# Altium schematic sheet Top_Sheet.SchDoc: Top Sheet
size 420 x 297 mm; Engineer: Zain Siddiqui; Revision: V1.0; SheetNumber: 1; SheetTotal: 8
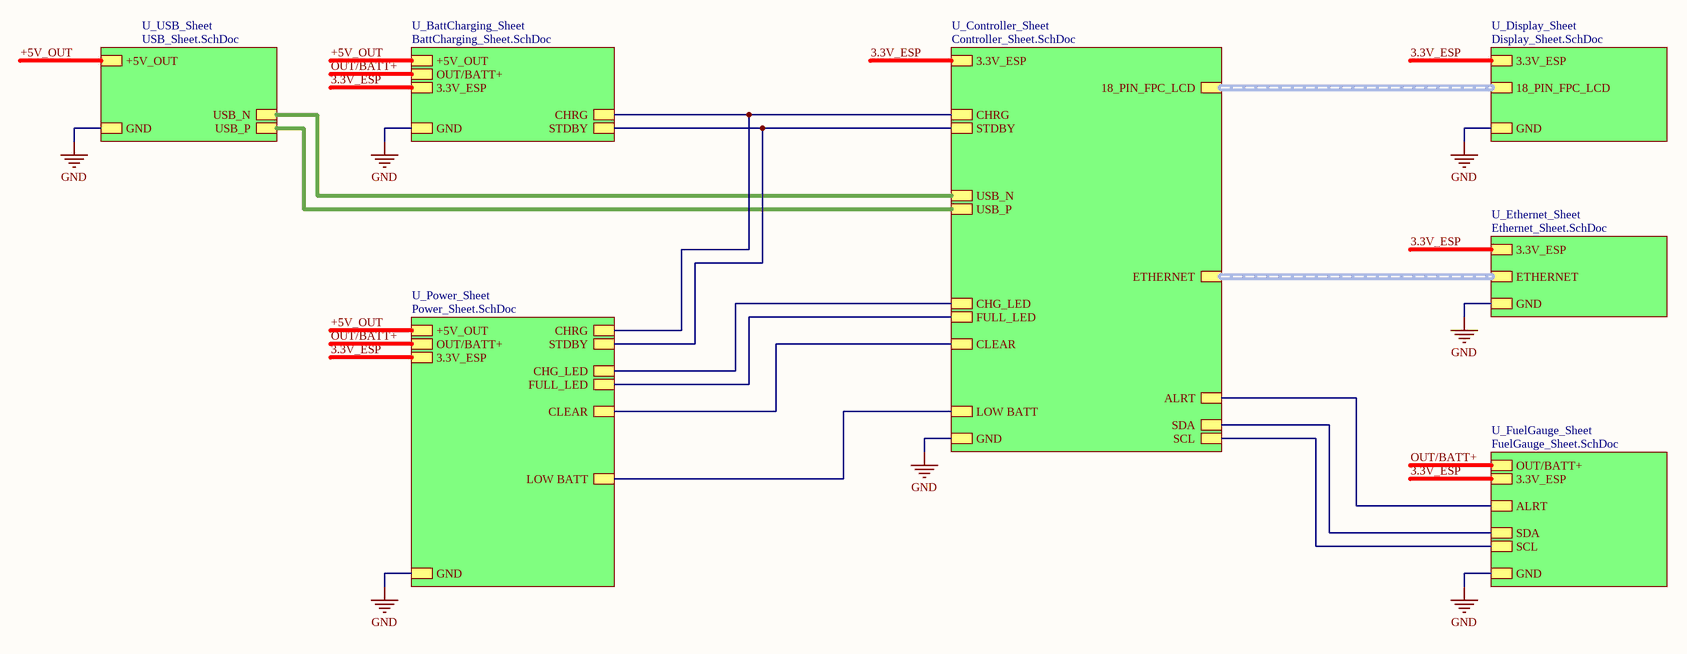
[diagram p0: Top_Sheet.SchDoc]

## Sub-sheets
U_BattCharging_Sheet = BattCharging_Sheet.SchDoc: +5V_OUT, GND, OUT/BATT+, 3.3V_ESP, CHRG, STDBY
U_Controller_Sheet = Controller_Sheet.SchDoc: CHRG, STDBY, CHG_LED, FULL_LED, CLEAR, LOW BATT, GND, 3.3V_ESP, 18_PIN_FPC_LCD (harness 18_PIN_FPC_LCD), ALRT, SDA, SCL, ETHERNET (harness ETHERNET), USB_N, USB_P
U_Display_Sheet = Display_Sheet.SchDoc: 18_PIN_FPC_LCD (harness 18_PIN_FPC_LCD), GND, 3.3V_ESP
U_Ethernet_Sheet = Ethernet_Sheet.SchDoc: ETHERNET (harness ETHERNET), GND, 3.3V_ESP
U_FuelGauge_Sheet = FuelGauge_Sheet.SchDoc: ALRT, SDA, SCL, GND, OUT/BATT+, 3.3V_ESP
U_Power_Sheet = Power_Sheet.SchDoc: CHRG, STDBY, +5V_OUT, GND, OUT/BATT+, 3.3V_ESP, CHG_LED, FULL_LED, CLEAR, LOW BATT
U_USB_Sheet = USB_Sheet.SchDoc: USB_N, USB_P, +5V_OUT, GND

## Nets
GND: sheet U_BattCharging_Sheet/GND, sheet U_Controller_Sheet/GND, sheet U_Display_Sheet/GND, sheet U_Ethernet_Sheet/GND, sheet U_FuelGauge_Sheet/GND, sheet U_Power_Sheet/GND, sheet U_USB_Sheet/GND
3.3V_ESP: sheet U_BattCharging_Sheet/3.3V_ESP, sheet U_Controller_Sheet/3.3V_ESP, sheet U_Display_Sheet/3.3V_ESP, sheet U_Ethernet_Sheet/3.3V_ESP, sheet U_FuelGauge_Sheet/3.3V_ESP, sheet U_Power_Sheet/3.3V_ESP
+5V_OUT: sheet U_BattCharging_Sheet/+5V_OUT, sheet U_Power_Sheet/+5V_OUT, sheet U_USB_Sheet/+5V_OUT
OUT/BATT+: sheet U_BattCharging_Sheet/OUT/BATT+, sheet U_FuelGauge_Sheet/OUT/BATT+, sheet U_Power_Sheet/OUT/BATT+
(unnamed): sheet U_BattCharging_Sheet/CHRG, sheet U_Controller_Sheet/CHRG, sheet U_Power_Sheet/CHRG
(unnamed): sheet U_BattCharging_Sheet/STDBY, sheet U_Controller_Sheet/STDBY, sheet U_Power_Sheet/STDBY
(unnamed): sheet U_Controller_Sheet/CHG_LED, sheet U_Power_Sheet/CHG_LED
(unnamed): sheet U_Controller_Sheet/FULL_LED, sheet U_Power_Sheet/FULL_LED
(unnamed): sheet U_Controller_Sheet/CLEAR, sheet U_Power_Sheet/CLEAR
(unnamed): sheet U_Controller_Sheet/LOW BATT, sheet U_Power_Sheet/LOW BATT
(unnamed): sheet U_Controller_Sheet/ALRT, sheet U_FuelGauge_Sheet/ALRT
(unnamed): sheet U_Controller_Sheet/SDA, sheet U_FuelGauge_Sheet/SDA
(unnamed): sheet U_Controller_Sheet/SCL, sheet U_FuelGauge_Sheet/SCL
(unnamed): sheet U_Controller_Sheet/USB_N, sheet U_USB_Sheet/USB_N
(unnamed): sheet U_Controller_Sheet/USB_P, sheet U_USB_Sheet/USB_P

## Buses and harness runs
harness sheet U_Controller_Sheet/18_PIN_FPC_LCD = sheet U_Display_Sheet/18_PIN_FPC_LCD
harness sheet U_Controller_Sheet/ETHERNET = sheet U_Ethernet_Sheet/ETHERNET

## Notes on the sheet
- PROJECT
- TITLE
- DATE
- FILE NAME
- A3
- SIZE
- ENGINEER
- SHEET
- REV
- OF